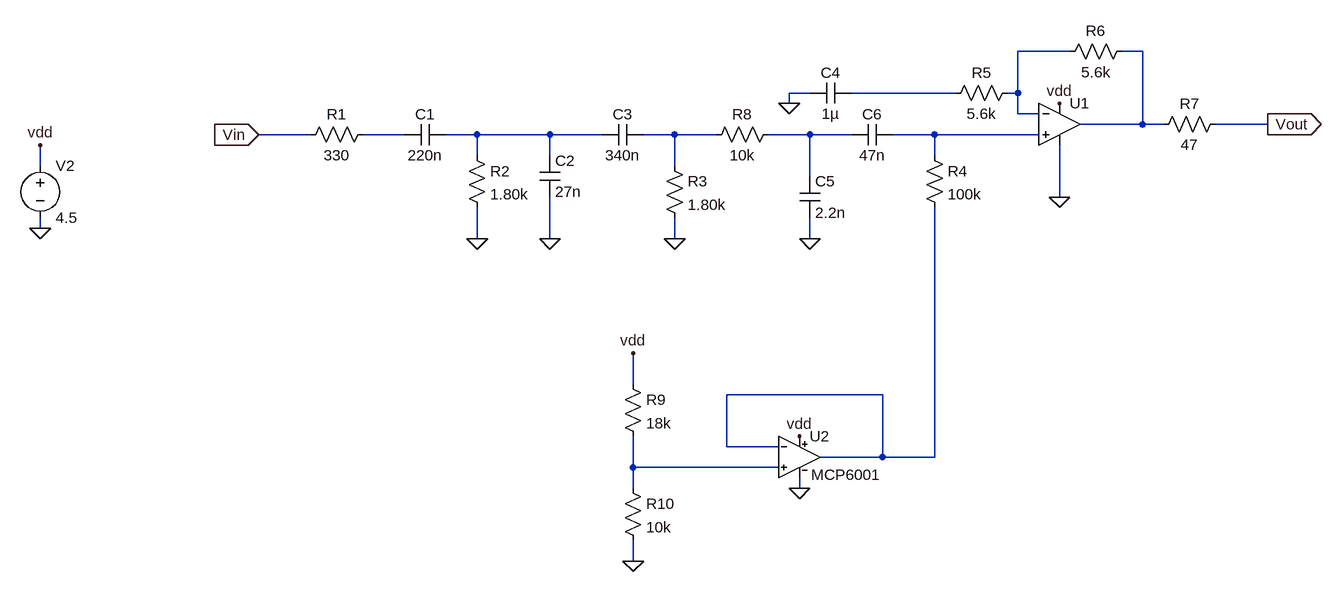
[diagram p0: schematic a_weighting_filter_para_testes.asc]
a_weighting_filter_para_testes.asc, the LTspice schematic file:
Version 4
SHEET 1 1712 680
WIRE 1296 -128 1216 -128
WIRE 1408 -128 1376 -128
WIRE 896 -64 864 -64
WIRE 1120 -64 960 -64
WIRE 1216 -64 1216 -128
WIRE 1216 -64 1200 -64
WIRE 864 -48 864 -64
WIRE 1216 -32 1216 -64
WIRE 1248 -32 1216 -32
WIRE 1408 -16 1408 -128
WIRE 1408 -16 1312 -16
WIRE 1440 -16 1408 -16
WIRE 1600 -16 1520 -16
WIRE 128 0 48 0
WIRE 272 0 208 0
WIRE 384 0 336 0
WIRE 496 0 384 0
WIRE 576 0 496 0
WIRE 688 0 640 0
WIRE 752 0 688 0
WIRE 896 0 832 0
WIRE 960 0 896 0
WIRE 1088 0 1024 0
WIRE 1248 0 1088 0
WIRE 384 32 384 0
WIRE 496 32 496 0
WIRE 1088 32 1088 0
WIRE -288 48 -288 16
WIRE 688 48 688 0
WIRE 896 64 896 0
WIRE 1280 96 1280 16
WIRE -288 144 -288 128
WIRE 384 160 384 112
WIRE 496 160 496 96
WIRE 688 160 688 128
WIRE 896 160 896 128
WIRE 624 384 624 336
WIRE 1008 400 768 400
WIRE 768 480 768 400
WIRE 848 480 768 480
WIRE 1008 496 1008 400
WIRE 1008 496 912 496
WIRE 1088 496 1088 112
WIRE 1088 496 1008 496
WIRE 624 512 624 464
WIRE 848 512 624 512
WIRE 624 544 624 512
WIRE 880 544 880 528
WIRE 624 656 624 624
FLAG 384 160 0
FLAG 496 160 0
FLAG 688 160 0
FLAG 896 160 0
FLAG -288 144 0
FLAG -288 16 vdd
FLAG 1280 -48 vdd
FLAG 1600 -16 Vout
IOPIN 1600 -16 Out
FLAG 1280 96 0
FLAG 624 656 0
FLAG 624 336 vdd
FLAG 880 544 0
FLAG 880 464 vdd
FLAG 864 -48 0
FLAG 48 0 Vin
IOPIN 48 0 In
SYMBOL res 224 -16 R90
WINDOW 0 0 56 VBottom 2
WINDOW 3 32 56 VTop 2
SYMATTR InstName R1
SYMATTR Value 330
SYMBOL res 368 16 R0
SYMATTR InstName R2
SYMATTR Value 1.80k
SYMBOL res 672 32 R0
SYMATTR InstName R3
SYMATTR Value 1.80k
SYMBOL res 1072 16 R0
SYMATTR InstName R4
SYMATTR Value 100k
SYMBOL res 1216 -80 R90
WINDOW 0 0 56 VBottom 2
WINDOW 3 32 56 VTop 2
SYMATTR InstName R5
SYMATTR Value 5.6k
SYMBOL res 1392 -144 R90
WINDOW 0 0 56 VBottom 2
WINDOW 3 32 56 VTop 2
SYMATTR InstName R6
SYMATTR Value 5.6k
SYMBOL res 1536 -32 R90
WINDOW 0 0 56 VBottom 2
WINDOW 3 32 56 VTop 2
SYMATTR InstName R7
SYMATTR Value 47
SYMBOL cap 336 -16 R90
WINDOW 0 0 32 VBottom 2
WINDOW 3 32 32 VTop 2
SYMATTR InstName C1
SYMATTR Value 220n
SYMBOL cap 480 32 R0
SYMATTR InstName C2
SYMATTR Value 27n
SYMBOL res 848 -16 R90
WINDOW 0 0 56 VBottom 2
WINDOW 3 32 56 VTop 2
SYMATTR InstName R8
SYMATTR Value 10k
SYMBOL cap 880 64 R0
SYMATTR InstName C5
SYMATTR Value 2.2n
SYMBOL cap 1024 -16 R90
WINDOW 0 0 32 VBottom 2
WINDOW 3 32 32 VTop 2
SYMATTR InstName C6
SYMATTR Value 47n
SYMBOL cap 640 -16 R90
WINDOW 0 0 32 VBottom 2
WINDOW 3 32 32 VTop 2
SYMATTR InstName C3
SYMATTR Value 340n
SYMBOL voltage -288 32 R0
WINDOW 123 0 0 Left 0
WINDOW 39 0 0 Left 0
SYMATTR InstName V2
SYMATTR Value 4.5
SYMBOL OpAmps\\UniversalOpAmp2 1280 -16 R0
SYMATTR InstName U1
SYMBOL res 608 368 R0
SYMATTR InstName R9
SYMATTR Value 18k
SYMBOL res 608 528 R0
SYMATTR InstName R10
SYMATTR Value 10k
SYMBOL MCP6001_AB 880 432 R0
SYMATTR InstName U2
SYMBOL cap 960 -80 R90
WINDOW 0 0 32 VBottom 2
WINDOW 3 32 32 VTop 2
SYMATTR InstName C4
SYMATTR Value 1µ

The netlist it stands for:
* a_weighting_filter_para_testes.asc
R1 N004 Vin 330
R2 N005 0 1.80k
R3 N006 0 1.80k
R4 N008 N009 100k
R5 N001 N003 5.6k
R6 N002 N001 5.6k
R7 Vout N002 47
C1 N005 N004 220n
C2 N005 0 27n
R8 N007 N006 10k
C5 N007 0 2.2n
C6 N008 N007 47n
C3 N006 N005 340n
V2 vdd 0 4.5
XU1 N008 N001 vdd 0 N002 level2 Avol=1Meg GBW=10Meg Slew=10Meg Ilimit=25m Rail=0 Vos=0 En=0 Enk=0 In=0 Ink=0 Rin=500Meg  ; pins In+ In- V+ V- OUT
R9 vdd N010 18k
R10 N010 0 10k
XU2 N010 N009 vdd 0 N009 MCP6001  ; pins In+ In- V+ V- OUT
C4 N003 0 1µ
.lib UniversalOpAmp2.lib
.lib MCP6001.lib
.backanno
.end